# Altium schematic sheet AutoPlantWatering.SchDoc
size A3
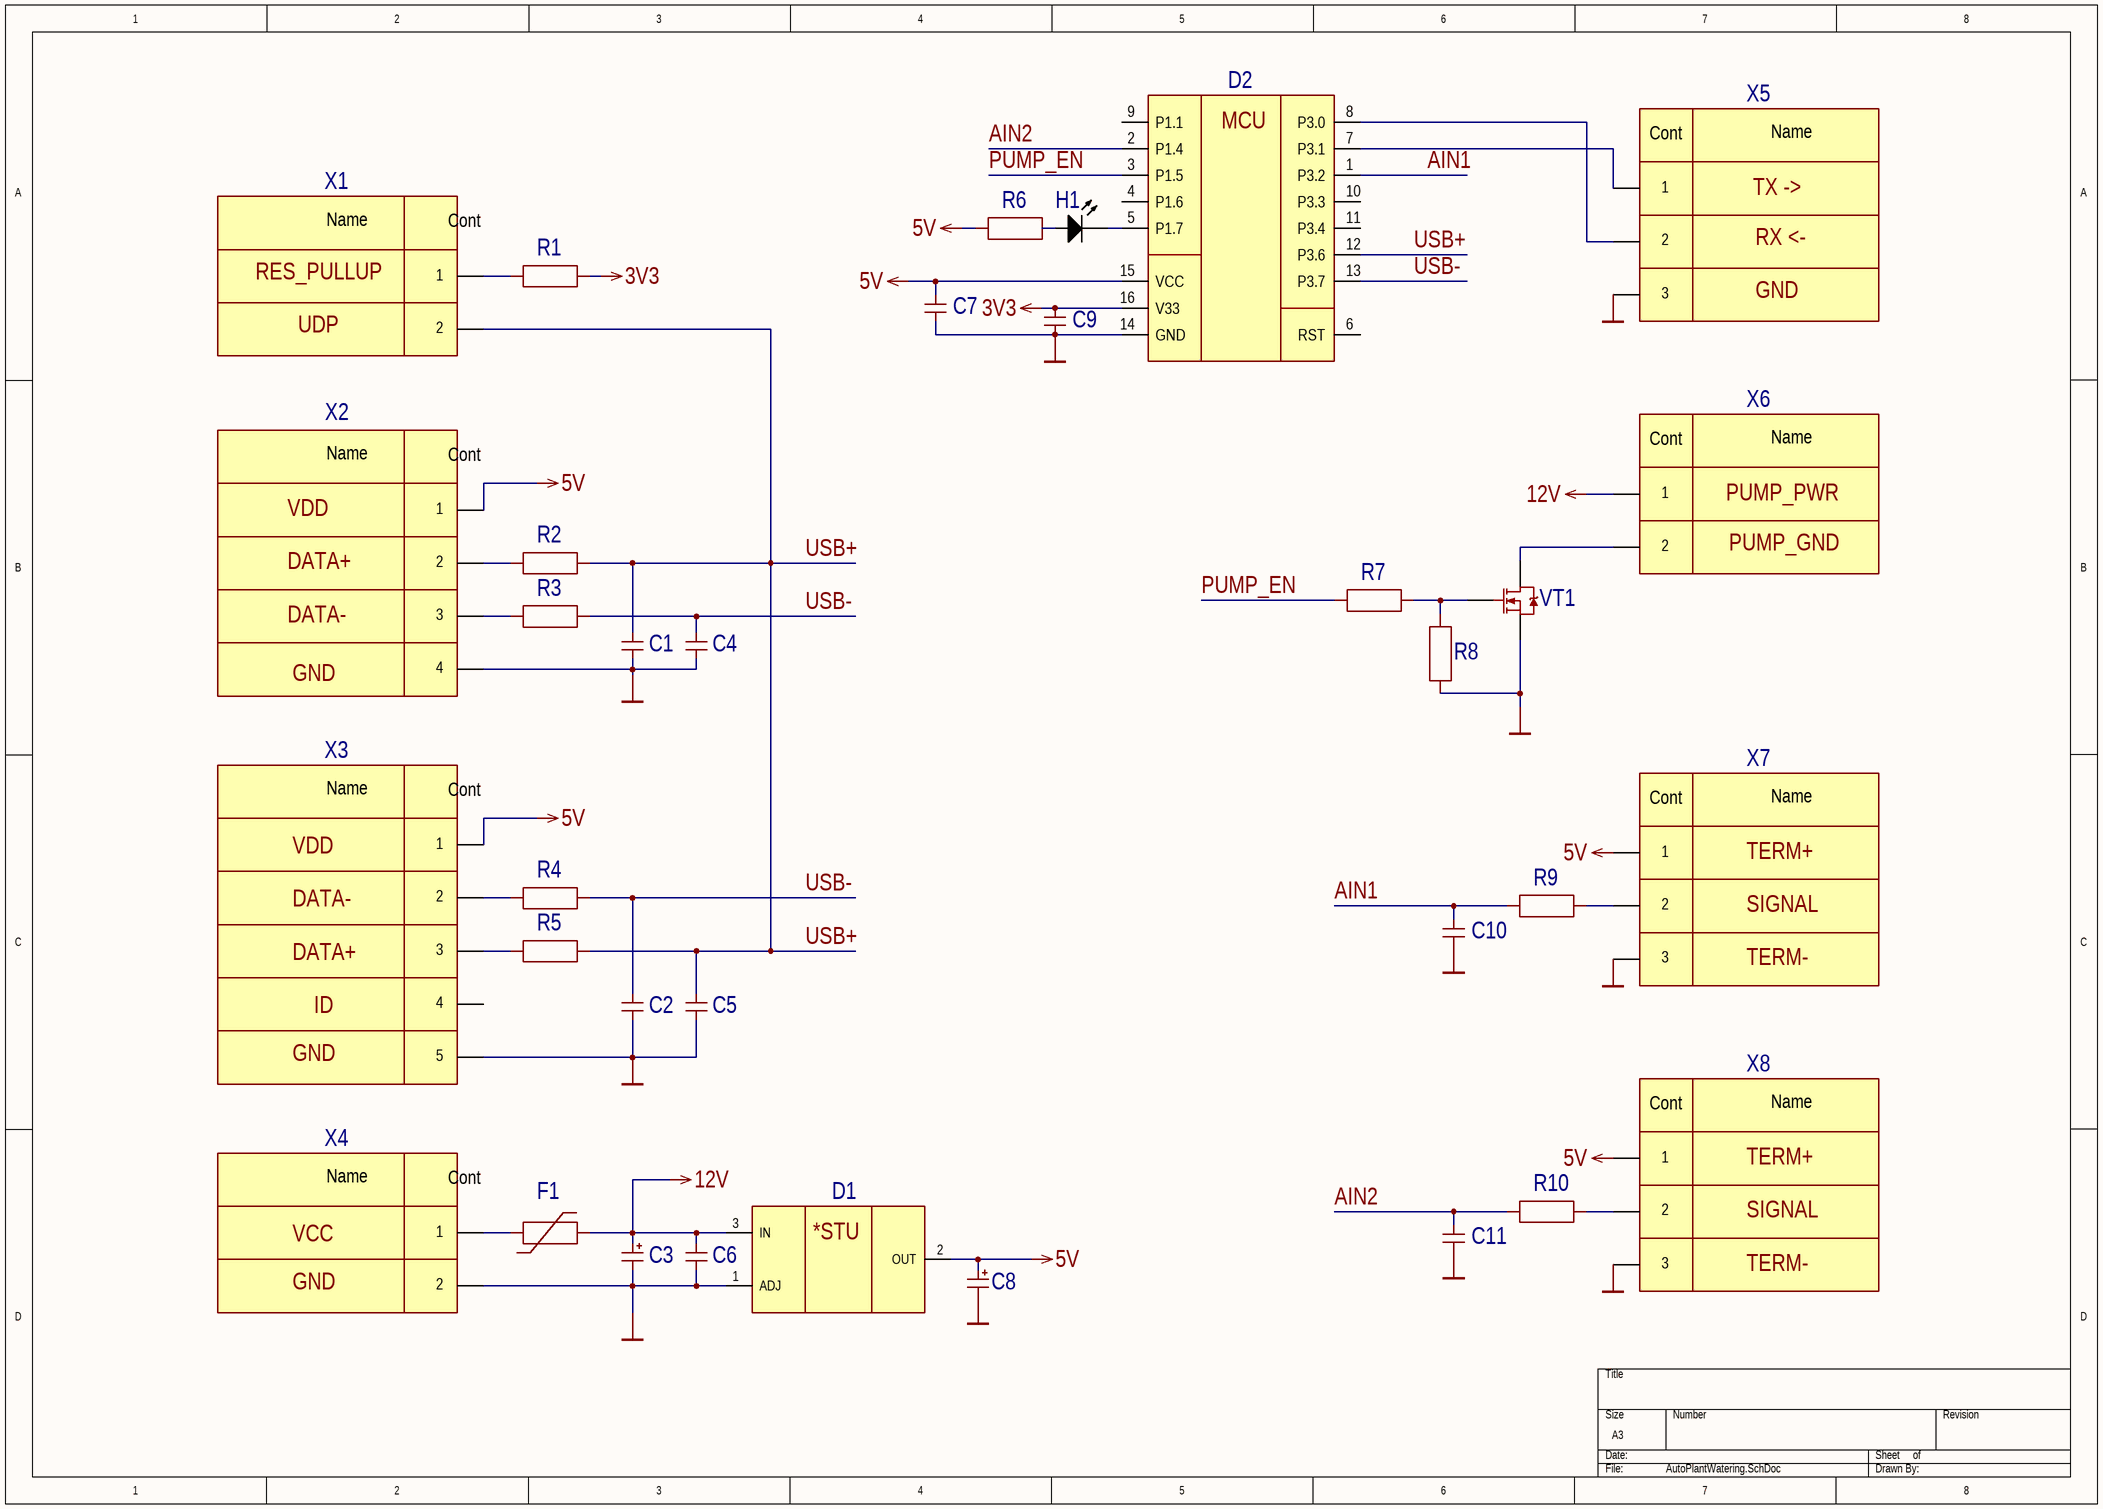
[diagram p0: AutoPlantWatering.SchDoc]

## Parts
C1  0805-50 V-COG-47pF±5 %  [SMD-0805C]  (value not drawn)
C2  0805-50 V-COG-47pF±5 %  [SMD-0805C]  (value not drawn)
C3  D-20 V-47uF±10 %  [CAP POL 2917/7343]  (value not drawn)
C4  0805-50 V-COG-47pF±5 %  [SMD-0805C]  (value not drawn)
C5  0805-50 V-COG-47pF±5 %  [SMD-0805C]  (value not drawn)
C6  0805-25 V-X5R-10uF±10 %  [SMD-0805C]  (value not drawn)
C7  0805-16 V-X7R-0.1uF±10 %  [SMD-0805C]  (value not drawn)
C8  A-10 V-22uF±10 %  [CAP_TAN_CASE_A]  (value not drawn)
C9  0805-16 V-X7R-0.1uF±10 %  [SMD-0805C]  (value not drawn)
C10  0805-16 V-X7R-0.1uF±10 %  [SMD-0805C]  (value not drawn)
C11  0805-16 V-X7R-0.1uF±10 %  [SMD-0805C]  (value not drawn)
D1  AMS1117-5.0  [SOT223_M]  (value not drawn)
D2  CH552G  [SO-16 _150mil]  (value not drawn)
F1  MF-MSMF050  [SMD-1812-FUSE]  (value not drawn)
H1  GNL-0805GC  [SMD-0805LED]  (value not drawn)
R1  0805±5 %-10 kOhm  [SMD-0805-RES]  (value not drawn)
R2  0805±5 %-22 Ohm  [SMD-0805-RES]  (value not drawn)
R3  0805±5 %-22 Ohm  [SMD-0805-RES]  (value not drawn)
R4  0805±5 %-22 Ohm  [SMD-0805-RES]  (value not drawn)
R5  0805±5 %-22 Ohm  [SMD-0805-RES]  (value not drawn)
R6  0805±5 %-1 kOhm  [SMD-0805-RES]  (value not drawn)
R7  0805±5 %-100 Ohm  [SMD-0805-RES]  (value not drawn)
R8  0805±5 %-10 kOhm  [SMD-0805-RES]  (value not drawn)
R9  0805±5 %-200 Ohm  [SMD-0805-RES]  (value not drawn)
R10  0805±5 %-200 Ohm  [SMD-0805-RES]  (value not drawn)
VT1  MMBF170LT1G  [SOT23_3]  (value not drawn)
X1  DS1022-11*2RD61  [PLS-2_D1]  (value not drawn)
X2  DS1021-1*4S61  [PLS-4]  (value not drawn)
X3  DS1104-B60SRS  [Mini-USB-B_HOLE]  (value not drawn)
X4  DC-005-5A-2.5-SMT  [PJ_2.5MM_SMT_HOLE]  (value not drawn)
X5  DS1022-11*3RD61  [PLS-3_D1]  (value not drawn)
X6  KLS2-125-3.81-02P-4S  [TERM_BLOCK_2]  (value not drawn)
X7  DS1021-1*3S61  [PLS-3]  (value not drawn)
X8  DS1021-1*3S61  [PLS-3]  (value not drawn)

## Nets
3V3: C9.2 D2.16(V33) R1.2
5V: C7.2 C8.1 D1.2(OUT) D2.15(VCC) R6.2 X2.1 X3.1 X7.1 X8.1
12V: C3.1 C6.2 D1.3(IN) F1.2 X6.1
GND: C1.1 C2.1 C3.2 C4.1 C5.1 C6.1 C7.1 C8.2 C9.1 C10.1 C11.1 D1.1(ADJ) D2.14(GND) R8.1 VT1.2(S) X2.4 X3.5 X4.2 X5.3 X7.3 X8.3
AIN1: C10.2 D2.1(P3.2) R9.1
AIN2: C11.2 D2.2(P1.4) R10.1
PUMP_EN: D2.3(P1.5) R7.1
USB+: C1.2 C5.2 D2.12(P3.6) R2.2 R5.2 X1.2
USB-: C2.2 C4.2 D2.13(P3.7) R3.2 R4.2
NetD2_5: D2.5(P1.7) H1.2(K)
NetD2_7: D2.7(P3.1) X5.1
NetD2_8: D2.8(P3.0) X5.2
NetF1_1: F1.1 X4.1
NetH1_1: H1.1(A) R6.1
NetR1_1: R1.1 X1.1
NetR2_1: R2.1 X2.2
NetR3_1: R3.1 X2.3
NetR4_1: R4.1 X3.2
NetR5_1: R5.1 X3.3
NetR7_2: R7.2 R8.2 VT1.1(G)
NetR9_2: R9.2 X7.2
NetR10_2: R10.2 X8.2
NetVT1_3: VT1.3(D) X6.2

Not connected (* = marked no-connect by the designer): D2 4(P1.6) 6(RST) 9(P1.1) 10(P3.3) 11(P3.4); X3 4

## Notes on the sheet
- TX ->
- RX <-
- RES_PULLUP
- GND
- UDP
- VDD
- PUMP_PWR
- DATA+
- PUMP_GND
- DATA-
- TERM+
- SIGNAL
- TERM-
- ID
- VCC
- (in symbol CH55xG) MCU
- (in symbol LM317) *STU
- (in symbol MINI-USB-B) Name; Cont
- (in symbol PLS-2) Name; Cont
- (in symbol PLS-3) Cont; Name
- (in symbol PLS-4) Name; Cont
- (in symbol Power_Jack_SMT_2.5mm) Name; Cont
- (in symbol TERM_BLOCK_2) Cont; Name

## Library data of the parts
C1 C2 C4 C5 = Cap: Capacitor; Value: 47 pF; Manufacturer: *; ComponentLink1Description: Datasheet
C3 = Cap_el: Electrolytic capacitor; Value: 47 uF; Manufacturer: *; ComponentLink1Description: Datasheet
C6 = Cap: Capacitor; Value: 10 uF; Manufacturer: *; ComponentLink1Description: Datasheet
C7 C9-C11 = Cap: Capacitor; Value: 0.1 uF; Manufacturer: *; ComponentLink1Description: Datasheet
C8 = Cap_el: Electrolytic capacitor; Value: 22 uF; Manufacturer: *; ComponentLink1Description: Datasheet
D1 = LM317: 3-Terminal Fixed Regulator; Manufacturer: Advanced Monolithic Systems; ComponentLink1Description: Datasheet; ComponentLink1URL: *
D2 = CH55xG: 8-bit USB microcontroller; Manufacturer: WCH; Datasheet: *
F1 = Mulrifuse: Multifuse; Manufacturer: Bourns; Value: *; ComponentLink1Description: Datasheet; ComponentLink1URL: *
H1 = LED: Typical INFRARED GaAs LED; Manufacturer: G-NOR ELECTRONICS; ComponentLink1Description: Datasheet; ComponentLink1URL: *
R1 R8 = Res: Resistor; Value: 10 kOhm; Manufacturer: *; ComponentLink1Description: Datasheet; ComponentLink1URL: *
R2-R5 = Res: Resistor; Value: 22 Ohm; Manufacturer: *; ComponentLink1Description: Datasheet; ComponentLink1URL: *
R6 = Res: Resistor; Value: 1 kOhm; Manufacturer: *; ComponentLink1Description: Datasheet; ComponentLink1URL: *
R7 = Res: Resistor; Value: 100 Ohm; Manufacturer: *; ComponentLink1Description: Datasheet; ComponentLink1URL: *
R9 R10 = Res: Resistor; Value: 200 Ohm; Manufacturer: *; ComponentLink1Description: Datasheet; ComponentLink1URL: *
VT1 = Transistor_N: N-channel FET; Manufacturer: ON Semiconductor; Datasheet: *
X1 = PLS-2: Connector PLS-2; Manufacturer: Connfly Electronic; ComponentLink1Description: Datasheet; ComponentLink1URL: *
X2 = PLS-4: PLS-4 connector; Manufacturer: Connfly Electronic; ComponentLink1Description: Datasheet; ComponentLink1URL: *
X3 = MINI-USB-B: Mini USB-B connector; Manufacturer: Connfly Electronics; ComponentLink1Description: Datasheet; ComponentLink1URL: *
X4 = Power_Jack_SMT_2.5mm: Power jack 2.5 mm SMT connector; Manufacturer: XKB Connectivity
X5 = PLS-3: PLS SMD connector; Manufacturer: Connfly Electronics; ComponentLink1Description: Datasheet; ComponentLink1URL: *
X6 = TERM_BLOCK_2: Terminal block connector; 2 position; Manufacturer: KLS; ComponentLink1Description: Datasheet; ComponentLink1URL: *
X7 X8 = PLS-3: PLS connector; Manufacturer: Connfly Electronics; ComponentLink1Description: Datasheet; ComponentLink1URL: *